# EAGLE schematic SPIShortcut (EAGLE 6.4)
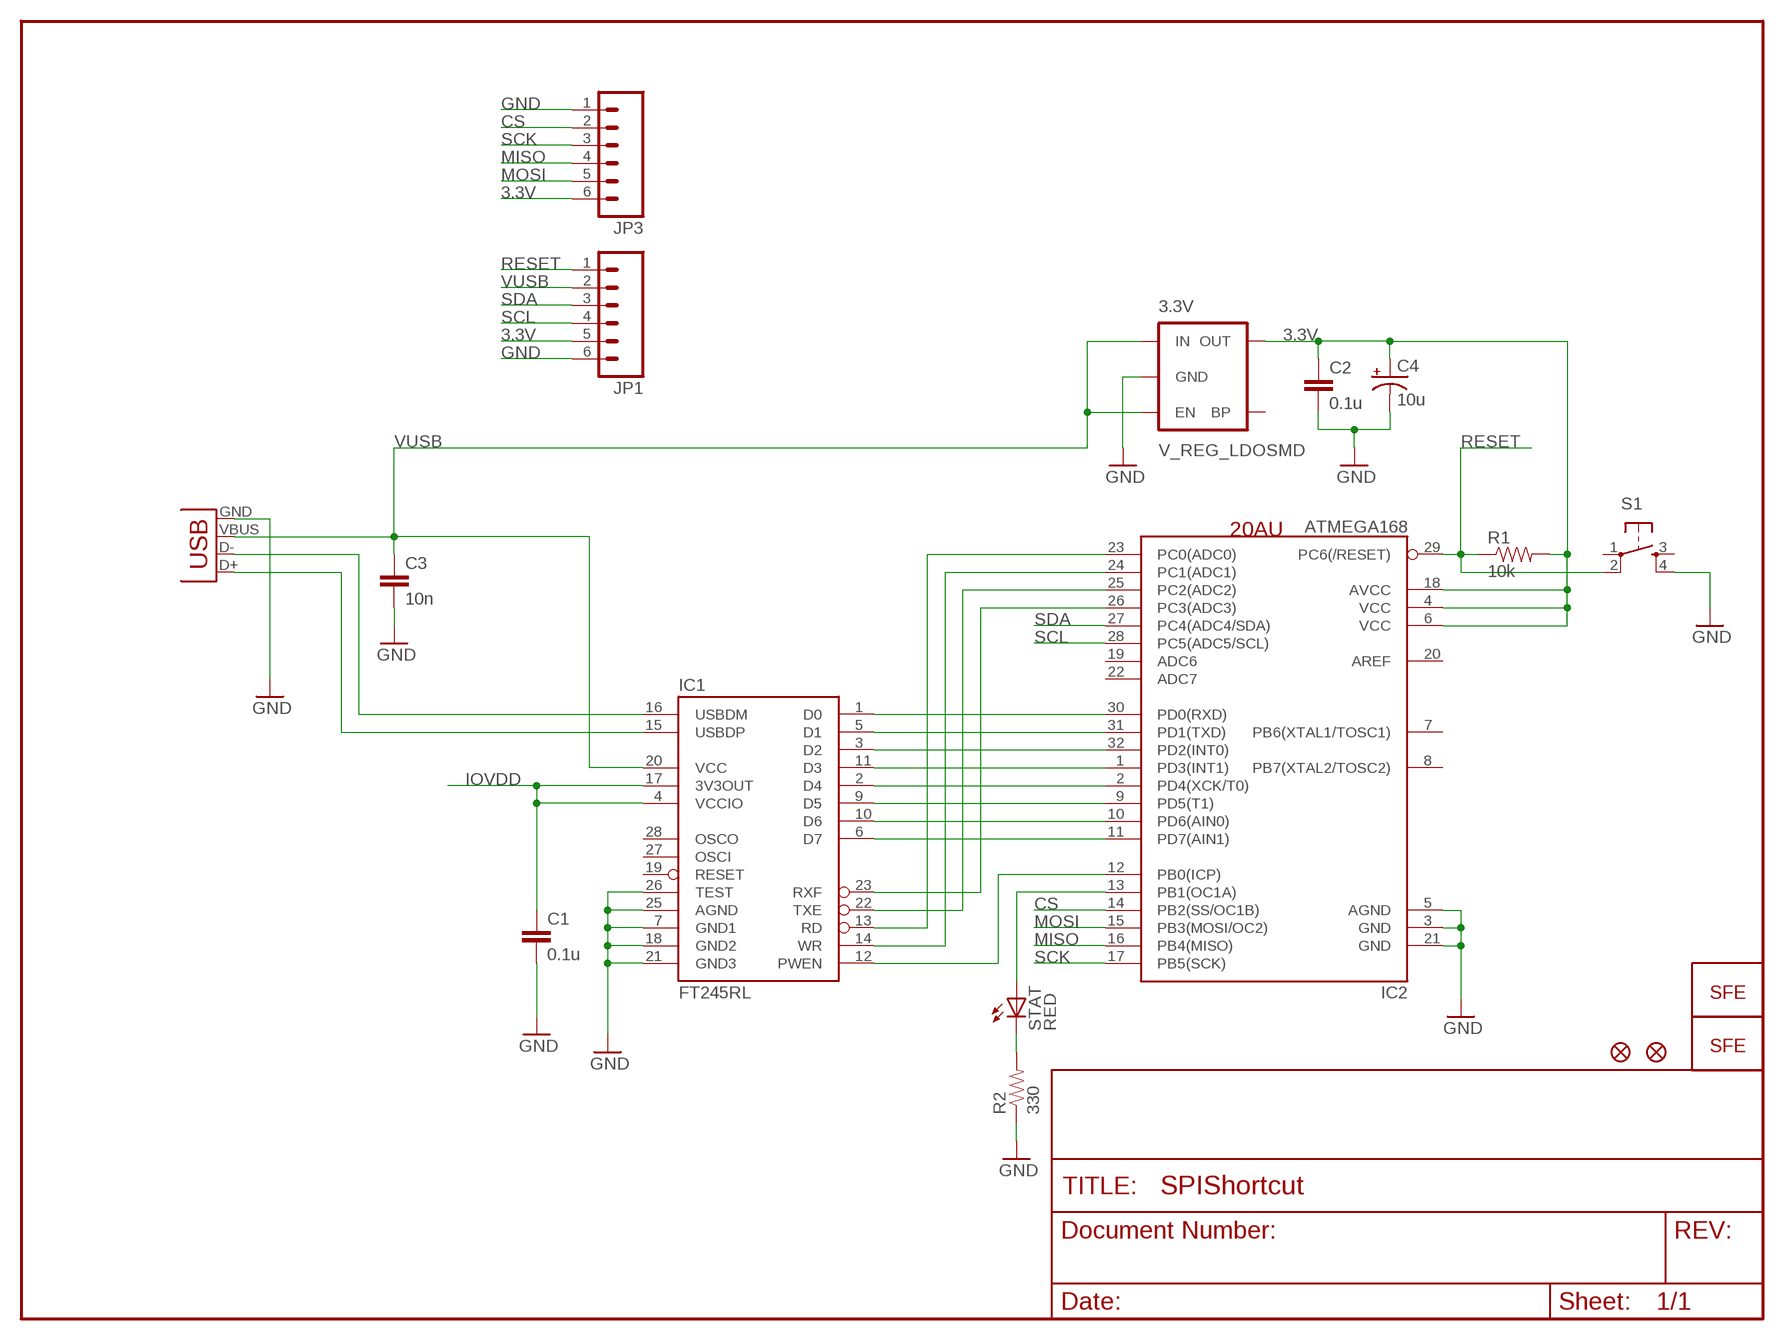
[diagram p0: schematic, sheet 1]

## Parts
3.3V  V_REG_LDOSMD  [SOT23-5]
C1  0.1u  CAP0402-CAP  [0402-CAP]
C2  0.1u  CAP0402-CAP  [0402-CAP]
C3  10n  CAP0402-CAP  [0402-CAP]
C4  10u  CAP_POL1206  [EIA3216]
IC1  FT245RL  [SSOP28DB]
IC2  ATMEGA168  [TQFP32-08]
JP1  M06SIP  [1X06]
JP3  M06SIP  [1X06]
R1  10k  RESISTOR0402-RES  [0402-RES]
R2  330  RESISTOR0402-RES  [0402-RES]
S1  TAC_SWITCHSMD  [TACTILE_SWITCH_SMD]
STAT  RED  LED0603  [LED-0603]
U$3  LOGO-SFENEW  [SFE-NEW-WEBLOGO]
U$5  FIDUCIAL1X2  [FIDUCIAL-1X2]
U$6  FIDUCIAL1X2  [FIDUCIAL-1X2]
U$7  LOGO-SFESK  [SFE-LOGO-FLAME]
X1  USBSMD  [USB-MINIB]

## Nets
3.3V: 3.3V.5(OUT) C2.1 C4.A(+) IC2.4(VCC) IC2.6(VCC) IC2.18(AVCC) JP1.5 JP3.6 R1.2
CS: IC2.14(PB2(SS/OC1B)) JP3.2
GND: 3.3V.2(GND) C1.2 C2.2 C3.2 C4.C(-) IC1.7(GND1) IC1.18(GND2) IC1.21(GND3) IC1.25(AGND) IC1.26(TEST) IC2.3(GND) IC2.5(AGND) IC2.21(GND) JP1.6 JP3.1 R2.1 S1.4 X1.GND
IOVDD: C1.1 IC1.4(VCCIO) IC1.17(3V3OUT)
MISO: IC2.16(PB4(MISO)) JP3.4
MOSI: IC2.15(PB3(MOSI/OC2)) JP3.5
N$1: IC1.1(D0) IC2.30(PD0(RXD))
N$2: IC1.5(D1) IC2.31(PD1(TXD))
N$3: IC1.3(D2) IC2.32(PD2(INT0))
N$4: IC1.11(D3) IC2.1(PD3(INT1))
N$5: IC1.2(D4) IC2.2(PD4(XCK/T0))
N$6: IC1.9(D5) IC2.9(PD5(T1))
N$7: IC1.10(D6) IC2.10(PD6(AIN0))
N$8: IC1.6(D7) IC2.11(PD7(AIN1))
N$9: IC1.23(RXF) IC2.26(PC3(ADC3))
N$10: IC1.16(USBDM) X1.D-
N$11: IC1.15(USBDP) X1.D+
N$12: IC1.22(TXE) IC2.25(PC2(ADC2))
N$13: IC1.14(WR) IC2.24(PC1(ADC1))
N$14: IC1.13(RD) IC2.23(PC0(ADC0))
N$15: IC1.12(PWEN) IC2.12(PB0(ICP))
N$16: IC2.13(PB1(OC1A)) STAT.A
N$17: R2.2 STAT.C
RESET: IC2.29(PC6(/RESET)) JP1.1 R1.1 S1.2
SCK: IC2.17(PB5(SCK)) JP3.3
SCL: IC2.28(PC5(ADC5/SCL)) JP1.4
SDA: IC2.27(PC4(ADC4/SDA)) JP1.3
VUSB: 3.3V.1(IN) 3.3V.3(EN) C3.1 IC1.20(VCC) JP1.2 X1.VBUS
Unconnected: 3.3V.4(BP) IC1.19(RESET) IC1.27(OSCI) IC1.28(OSCO) IC2.7(PB6(XTAL1/TOSC1)) IC2.8(PB7(XTAL2/TOSC2)) IC2.19(ADC6) IC2.20(AREF) IC2.22(ADC7) S1.1 S1.3

## Notes on the sheet
- 20AU

## Library data of the parts
3.3V = SparkFun:V_REG_LDO: Voltage Regulator LDO Standard 150mA LDO voltage regulator in SOT-23 layout. Micrel part MIC5205. BP (by-pass) pin is used to lower output noise with 470pF cap.
C1-C3 = SparkFun:CAP: Capacitor Standard 0603 ceramic capacitor, and 0.1" leaded capacitor.
C4 = SparkFun:CAP_POL: Capacitor Polarized These are standard SMD and PTH capacitors. Normally 10uF, 47uF, and 100uF in electrolytic and tantalum varieties. Always verify the external diameter of the through hole cap, it varies with capacity, voltage, and manufacturer. The EIA devices should be standard.
IC1 = SparkFun:FT245RL: USB FIFO Controller 4th Generation USB Controller (USB <-> Parallel) - FIFO. Spark Fun Electronics SKU : COM-00787
IC2 = SparkFun:ATMEGA168
JP1 JP3 = SparkFun:M06: Header 6 Standard 6-pin 0.1" header. Use with straight break away headers (SKU : PRT-00116), right angle break away headers (PRT-00553), swiss pins (PRT-00743), machine pins (PRT-00117), and female headers (PRT-00115). Molex polarized connector foot print use with SKU : PRT-08094 with associated crimp pins and housings. NOTES ON THE VARIANTS LOCK and LOCK_LONGPADS... This footprint was designed to help hold the alignment of a through-hole component (i.e. 6-pin header) while soldering it into place. You may notice that each hole has been shifted either up or down by 0.005 of an inch from it's more standard position (which is a perfectly straight line). This slight alteration caused the pins (the squares in the middle) to touch the edges of the holes. Because they are alternating, it causes a "brace" to hold the component in place. 0.005 has proven to be the perfect amount of "off-center" position when using our standard breakaway headers. Although looks a little odd when you look at the bare footprint, once you have a header in there, the alteration is very hard to notice. Also, if you push a header all the way into place, it is covered up entirely on the bottom side. This idea of altering the position of holes to aid alignment will be further integrated into the Sparkfun Library for other footprints. It can help hold any component with 3 or more connection pins.
R1 R2 = SparkFun:RESISTOR: Resistor Basic schematic elements and footprints for 0603, 1206, and PTH 1/10th watt (small) resistors.
S1 = SparkFun:TAC_SWITCH: Momentary Switch Button commonly used for reset or general input. Spark Fun Electronics SKU : COM-00097
STAT = SparkFun:LED: LEDs Standard schematic elements and footprints for 5mm, 3mm, 1206, and 0603 sized LEDs. 5mm - Spark Fun Electronics SKU : COM-00529 (and others)
U$3 U$7 = SparkFun:LOGO-SFE: Spark Fun Electronics PCB Logo This is the standard Spark Fun Electronics PCB logo.
U$5 U$6 = SparkFun:FIDUCIAL: Fiducial Alignment Points Various fiducial points for machine vision alignment.
X1 = SparkFun:USB: USB Connectors USB-B-PTH is fully proven SKU : PRT-00139 USB-miniB is fully proven SKU : PRT-00587 USB-A-PCB is untested. USB-A-H is throughly reviewed, but untested. Spark Fun Electronics SKU : PRT-00437 USB-B-SMT is throughly reviewed, but untested. Needs silkscreen touching up. USB-A-S has not been used/tested USB-MB-H has not been used/tested